# Altium schematic sheet mainV2.SchDoc
size A3; SheetNumber: 1; SheetTotal: 2
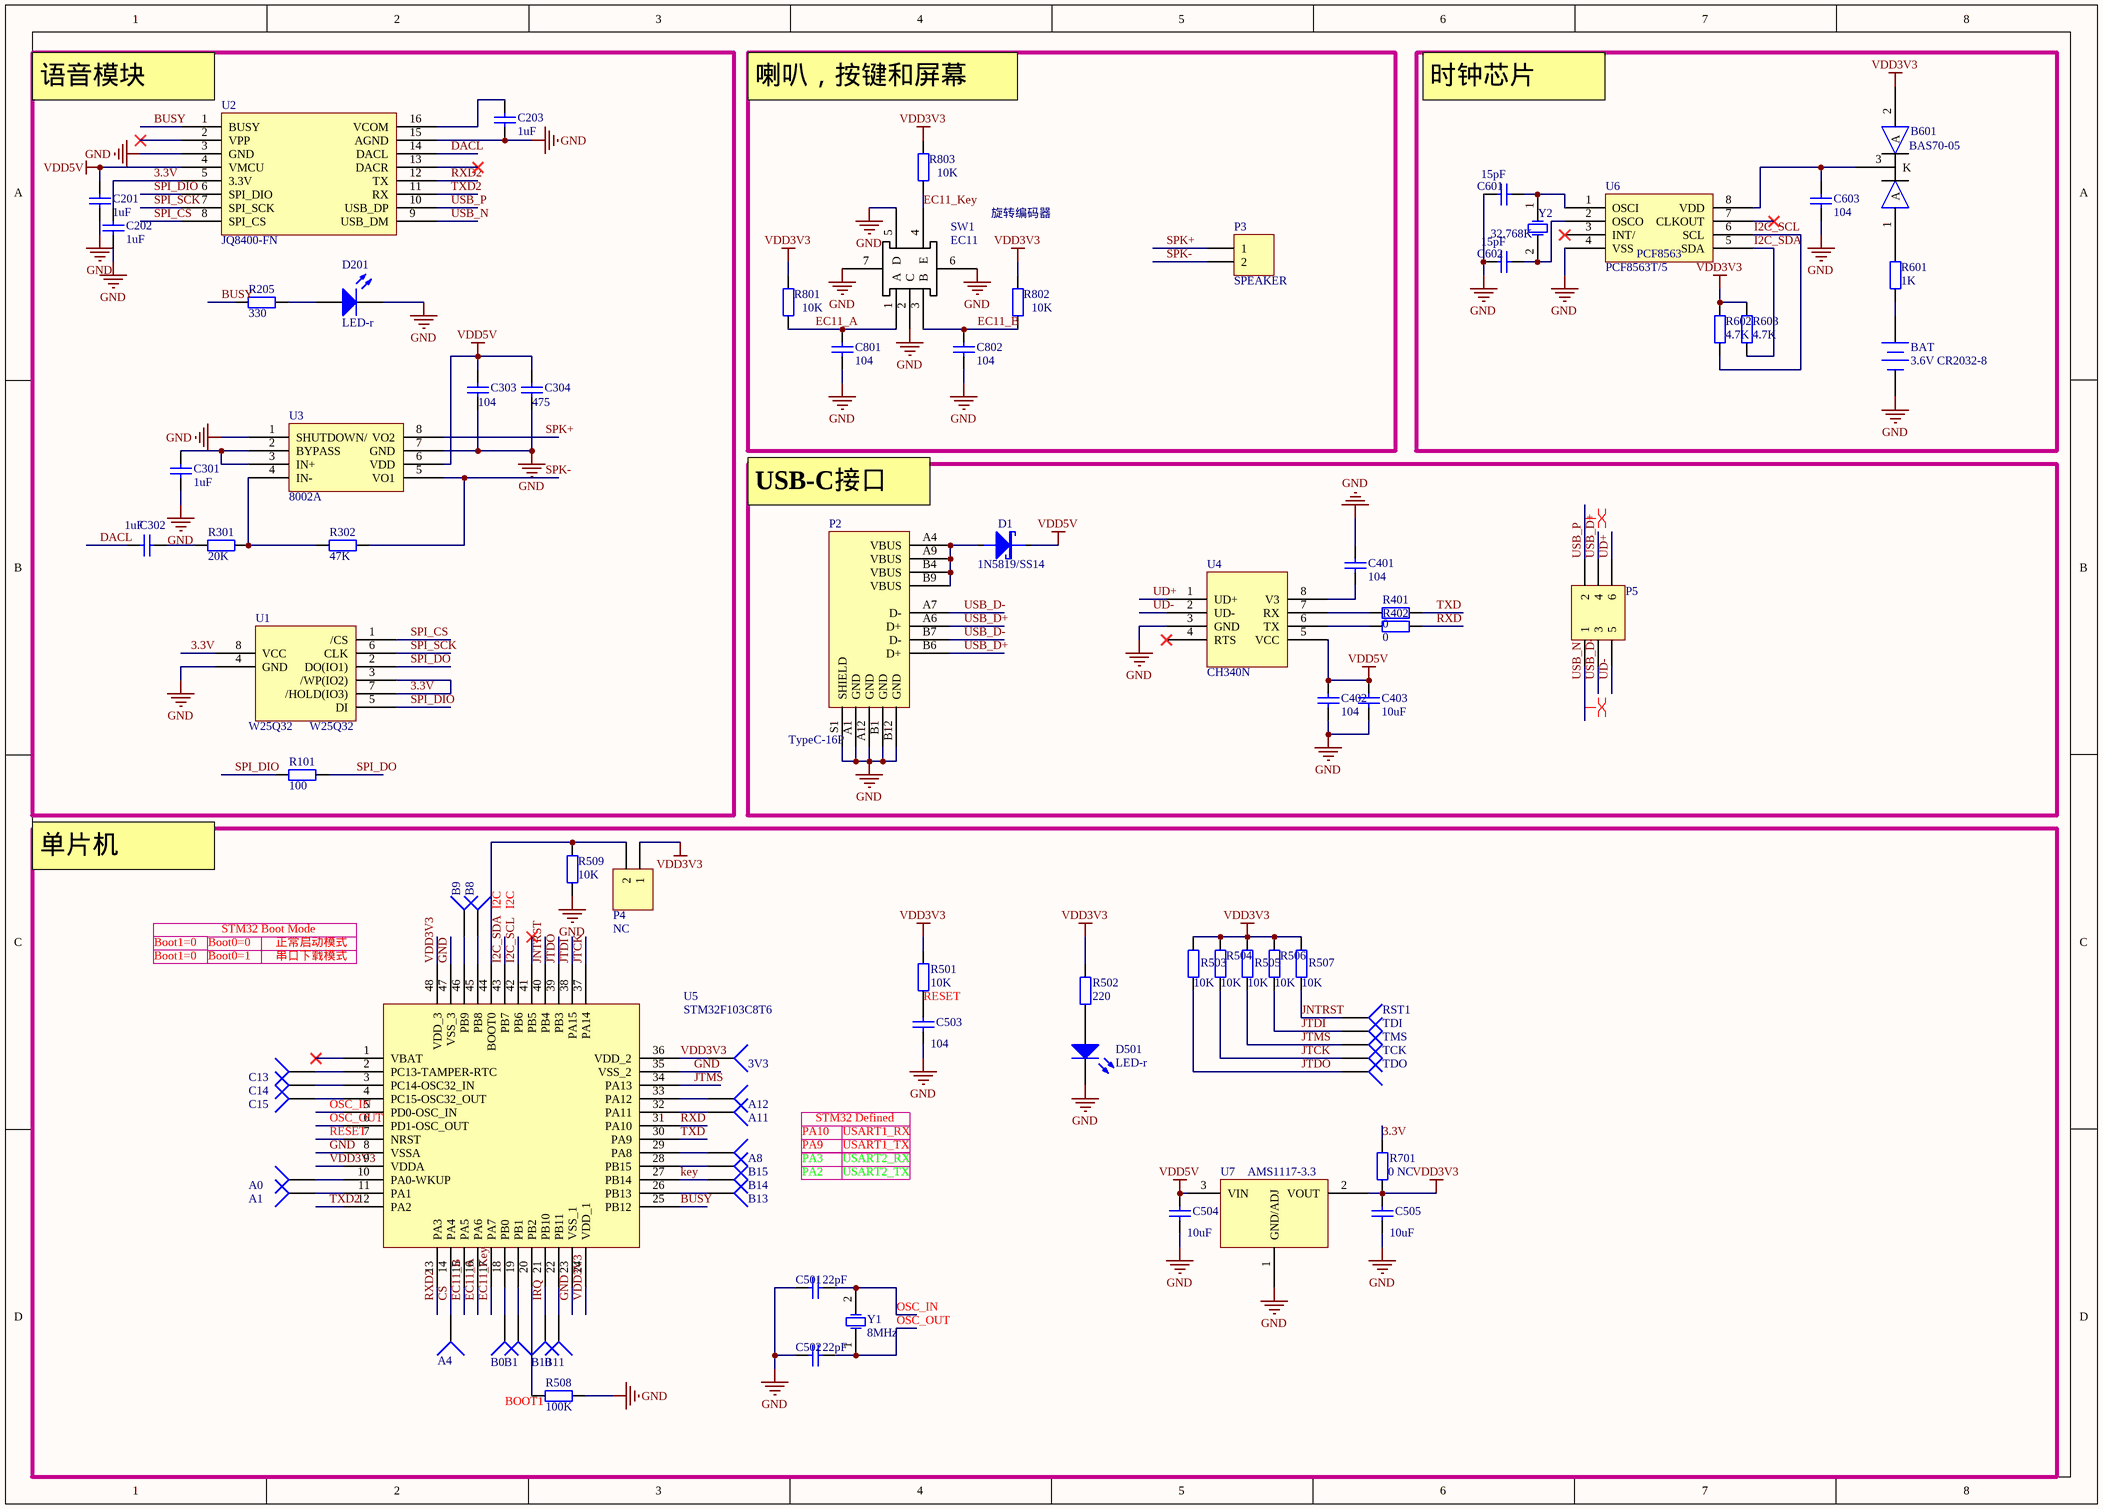
[diagram p0: mainV2.SchDoc]

## Parts
3V3  Socket  [TP]  (value not drawn)
A0  Socket  [TP]  (value not drawn)
A1  Socket  [TP]  (value not drawn)
A4  Socket  [TP]  (value not drawn)
A8  Socket  [TP]  (value not drawn)
A11  Socket  [TP]  (value not drawn)
A12  Socket  [TP]  (value not drawn)
B0  Socket  [TP]  (value not drawn)
B1  Socket  [TP]  (value not drawn)
B8  Socket  [TP]  (value not drawn)
B9  Socket  [TP]  (value not drawn)
B10  Socket  [TP]  (value not drawn)
B11  Socket  [TP]  (value not drawn)
B13  Socket  [TP]  (value not drawn)
B14  Socket  [TP]  (value not drawn)
B15  Socket  [TP]  (value not drawn)
B601  BAS70-05  [SMT_TRIODE_NPN]
BAT  3.6V CR2032-8  [CR2032-8]
C13  Socket  [TP]  (value not drawn)
C14  Socket  [TP]  (value not drawn)
C15  Socket  [TP]  (value not drawn)
C201  1uF  [0603_CAP]
C202  1uF  [0603_CAP]
C203  1uF  [0603_CAP]
C301  1uF  [0603_CAP]
C302  1uF  [0603_CAP]
C303  104  [0603_CAP]
C304  475  [0603_CAP]
C401  104  [0603_CAP]
C402  104  [0603_CAP]
C403  10uF  [0603_CAP]
C501  22pF  [0603_CAP]
C502  22pF  [0603_CAP]
C503  104  [0603_CAP]
C504  10uF  [0603_CAP]
C505  10uF  [0603_CAP]
C601  15pF  [0603_CAP]
C602  15pF  [0603_CAP]
C603  104  [0603_CAP]
C801  104  [0603_CAP]
C802  104  [0603_CAP]
D1  1N5819/SS14  [SMA]
D201  LED-r  [LED-0603]
D501  LED-r  [LED-0603]
P2  TypeC-16P  [type-c 16pin]
P3  SPEAKER  [Speaker]
P4  NC  [HDR1X2]
P5  NC 3X2  [HDR2X3]  (value not drawn)
R101  100  [0603_CAP]
R205  330  [0603_CAP]
R301  20K  [0603_CAP]
R302  47K  [0603_CAP]
R401  0  [0603_CAP]
R402  0  [0603_CAP]
R501  10K  [0603_CAP]
R502  220  [0603_CAP]
R503  10K  [0603_CAP]
R504  10K  [0603_CAP]
R505  10K  [0603_CAP]
R506  10K  [0603_CAP]
R507  10K  [0603_CAP]
R508  100K  [0603_CAP]
R509  10K  [0603_CAP]
R601  1K  [0603_CAP]
R602  4.7K  [0603_CAP]
R603  4.7K  [0603_CAP]
R701  0 NC  [0603_CAP]
R801  10K  [0603_CAP]
R802  10K  [0603_CAP]
R803  10K  [0603_CAP]
RST1  Socket  [TP]  (value not drawn)
SW1  EC11  [EC11]
TCK  Socket  [TP]  (value not drawn)
TDI  Socket  [TP]  (value not drawn)
TDO  Socket  [TP]  (value not drawn)
TMS  Socket  [TP]  (value not drawn)
U1  W25Q32  [SOP8-208mil]
U2  JQ8400-FN  [JQF8400-FL]
U3  8002A  [8002A]
U4  CH340N  [SOP8]
U5  STM32F103C8T6  [LQFP48]
U6  PCF8563T/5  [PCF8563]
U7  AMS1117-3.3  [SOT-223]
Y1  8MHz  [HC-49SMD]
Y2  32.768K  [Crystal]

## Blocks framed on the sheet
旋转编码器: C801 C802 P3 R801-R803 SW1

## Nets
GND: BAT.2(-) C201.1 C202.1 C203.2 C301.1 C303.2 C304.2 C401.2 C402.1 C403.1 C501.2 C502.2 C503.2 C504.2 C505.2 C601.2 C602.2 C603.2 C801.2 C802.2 D201.2(K) D501.2(K) P2.A1(GND) P2.A12(GND) P2.B1(GND) P2.B12(GND) P2.S1(SHIELD) R508.2 R509.1 SW1.2(C) SW1.5(D) SW1.6 SW1.7 U1.4(GND) U2.3(GND) U2.15(AGND) U3.1(SHUTDOWN/) U3.7(GND) U4.3(GND) U5.8(VSSA) U5.23(VSS_1) U5.35(VSS_2) U5.47(VSS_3) U6.4(VSS) U7.1(GND/ADJ)
VDD3V3: 3V3.1 B601.2(A) C505.1 P4.1 R501.2 R502.2 R503.2 R504.2 R505.2 R506.2 R507.2 R602.2 R603.2 R701.1 R801.1 R802.1 R803.1 U5.9(VDDA) U5.24(VDD_1) U5.36(VDD_2) U5.48(VDD_3) U7.2(VOUT)
VDD5V: C201.2 C303.1 C304.1 C402.2 C403.2 C504.1 D1.2(K) U2.4(VMCU) U3.6(VDD) U4.5(VCC) U7.3(VIN)
3.3V: C202.2 R701.2 U1.3(/WP(IO2)) U1.7(/HOLD(IO3)) U1.8(VCC) U2.5(3.3V)
BUSY: R205.2 U2.1(BUSY) U5.25(PB12)
CS: A4.1 U5.14(PA4)
DACL: C302.2 U2.14(DACL)
EC11_A: C801.1 R801.2 SW1.1(A) U5.16(PA6)
EC11_B: C802.1 R802.2 SW1.3(B) U5.15(PA5)
EC11_Key: R803.2 SW1.4(E) U5.17(PA7)
I2C_SCL: R602.1 U5.42(PB6) U6.6(SCL)
I2C_SDA: R603.1 U5.43(PB7) U6.5(SDA)
IRQ: B10.1 U5.21(PB10)
JNTRST: R507.1 RST1.1 U5.40(PB4)
JTCK: R504.1 TCK.1 U5.37(PA14)
JTDI: R506.1 TDI.1 U5.38(PA15)
JTDO: R503.1 TDO.1 U5.39(PB3)
JTMS: R505.1 TMS.1 U5.34(PA13)
key: B14.1 U5.27(PB14)
OSC_IN: C501.1 U5.5(PD0-OSC_IN) Y1.2(OSC2)
OSC_OUT: C502.1 U5.6(PD1-OSC_OUT) Y1.1(OSC1)
RESET: C503.1 R501.1 U5.7(NRST)
RXD: R402.2 U5.31(PA10)
RXD2: U2.12(TX) U5.13(PA3)
SPI_CS: U1.1(/CS) U2.8(SPI_CS)
SPI_DIO: R101.2 U1.5(DI) U2.6(SPI_DIO)
SPI_DO: R101.1 U1.2(DO(IO1))
SPI_SCK: U1.6(CLK) U2.7(SPI_SCK)
SPK+: P3.1 U3.8(VO2)
SPK-: P3.2 R302.1 U3.5(VO1)
TXD: R401.2 U5.30(PA9)
TXD2: U2.11(RX) U5.12(PA2)
UD+: P5.6 U4.1(UD+)
UD-: P5.5 U4.2(UD-)
USB_D+: P2.A6(D+) P2.B6(D+) P5.4
USB_D-: P2.A7(D-) P2.B7(D-) P5.3
USB_N: P5.1 U2.9(USB_DM)
USB_P: P5.2 U2.10(USB_DP)
NetA0_1: A0.1 U5.10(PA0-WKUP)
NetA1_1: A1.1 U5.11(PA1)
NetA8_1: A8.1 U5.29(PA8)
NetA11_1: A11.1 U5.32(PA11)
NetA12_1: A12.1 U5.33(PA12)
NetB0_1: B0.1 U5.18(PB0)
NetB1_1: B1.1 U5.19(PB1)
NetB8_1: B8.1 U5.45(PB8)
NetB9_1: B9.1 U5.46(PB9)
NetB11_1: B11.1 U5.22(PB11)
NetB13_1: B13.1 U5.26(PB13)
NetB15_1: B15.1 U5.28(PB15)
NetB601_1: B601.1(A) R601.2
NetB601_3: B601.3(K) C603.1 U6.8(VDD)
NetBAT_1: BAT.1(+) R601.1
NetC13_1: C13.1 U5.2(PC13-TAMPER-RTC)
NetC14_1: C14.1 U5.3(PC14-OSC32_IN)
NetC15_1: C15.1 U5.4(PC15-OSC32_OUT)
NetC203_1: C203.1 U2.16(VCOM)
NetC301_2: C301.2 U3.2(BYPASS) U3.3(IN+)
NetC302_1: C302.1 R301.2
NetC401_1: C401.1 U4.8(V3)
NetC601_1: C601.1 U6.1(OSCI) Y2.1(OSC1)
NetC602_1: C602.1 U6.2(OSCO) Y2.2(OSC2)
NetD1_1: D1.1(A) P2.A4(VBUS) P2.A9(VBUS) P2.B4(VBUS) P2.B9(VBUS)
NetD201_1: D201.1(A) R205.1
NetD501_1: D501.1(A) R502.1
NetP4_2: P4.2 R509.2 U5.44(BOOT0)
NetR301_1: R301.1 R302.2 U3.4(IN-)
NetR401_1: R401.1 U4.7(RX)
NetR402_1: R402.1 U4.6(TX)
NetR508_1: R508.1 U5.20(PB2)

Not connected (* = marked no-connect by the designer): U2 2(VPP)* 13(DACR)*; U4 4(RTS)*; U5 1(VBAT)* 41(PB5)*; U6 3(INT/)* 7(CLKOUT)*

## Layout directives
differential pair: USB_N, USB_P

## Notes on the sheet
- (near U2) 语音模块
- 喇叭，按键和屏幕
- 时钟芯片
- (near P2) USB-C接口
- 单片机
- (near B8) I2C
- I2C
- Boot1=0
- Boot0=1
- Boot0=0
- STM32 Boot Mode
- 串口下载模式
- 正常启动模式
- STM32 Defined
- PA9
- PA10
- PA2
- PA3
- USART1_RX
- USART1_TX
- USART2_RX
- USART2_TX
- (near R508) BOOT1

## Library data of the parts
B601 = BAS70 74: 贴片三极管  丝印75
BAT = Battery: 电池座 半圆形; Published: 24-Mar-1999; LatestRevisionDate: 17-Jul-2002; LatestRevisionNote: Re-released for DXP Platform.; PackageReference: BAT-2; Publisher: Altium Limited
C201-C203 C301-C304 C401-C403 C501-C505 C601-C603 C801 C802 = Cap: Capacitor 0603; Published: 8-Jun-2000; LatestRevisionDate: 17-Jul-2002; LatestRevisionNote: Re-released for DXP Platform.; PackageReference: RAD-0.3; Publisher: Altium Limited
  C201-C203 C301-C304 C401-C403: PackageDescription: Radial Cap, Thru-Hole; 2 Leads; 0.3 in Pin Spacing
D1 = SMT_DIODE_SCHOTTKY_SOD_323: 肖特基整流二极管SOD-323
D201 D501 = LED2: NC; Published: 8-Jun-2000; LatestRevisionDate: 17-Jul-2002; LatestRevisionNote: Re-released for DXP Platform.; PackageVersion: Feb-2002; PackageReference: 3.2X1.6X1.1; Publisher: Altium Limited
P3 = Header 2: 扬声器; LatestRevisionDate: 17-Jul-2002; LatestRevisionNote: Re-released for DXP Platform.; Publisher: Altium Limited
P4 = Header 2: 下载短接口; LatestRevisionDate: 17-Jul-2002; LatestRevisionNote: Re-released for DXP Platform.; Publisher: Altium Limited
P5 = Header 3X2: USB跳线接口; LatestRevisionDate: 17-Jul-2002; LatestRevisionNote: Re-released for DXP Platform.; Publisher: Altium Limited
R101 R205 R301 R302 R401 R402 R501-R509 R601-R603 R701 R801-R803 = Res2: Resistor 0603; Published: 8-Jun-2000; LatestRevisionDate: 17-Jul-2002; LatestRevisionNote: Re-released for DXP Platform.; PackageReference: AXIAL-0.4; Publisher: Altium Limited
  R101 R205 R301 R302 R401 R402 R801-R803: PackageDescription: Axial Device, Thru-Hole; 2 Leads; 0.4 in Pin Spacing
SW1 = EC11: 旋转编码器20脉冲
U1 = W25Q32: Flash
U3 = 8002A: 3W功放
U4 = ch340: U转串
U5 = STM32F101CB: 单片机
U6 = PCF8563: 时钟芯片
U7 = NCP1117
Y1 = XTAL: 49S型直插无源晶振; Published: 8-Jun-2000; LatestRevisionDate: 17-Jul-2002; LatestRevisionNote: Re-released for DXP Platform.; PackageReference: R38; Publisher: Altium Limited
Y2 = XTAL: 圆柱型3*8mm无源晶振; Published: 8-Jun-2000; LatestRevisionDate: 17-Jul-2002; LatestRevisionNote: Re-released for DXP Platform.; PackageReference: R38; Publisher: Altium Limited
3V3 A0 A1 A4 A8 A11 A12 B0 B1 B8-B11 B13-B15 C13-C15 RST1 TCK TDI TDO TMS = Socket: LatestRevisionDate: 17-Jul-2002; LatestRevisionNote: Re-released for DXP Platform.; Publisher: Altium Limited